# EAGLE schematic MJ828 - POC (EAGLE 9.4.0)
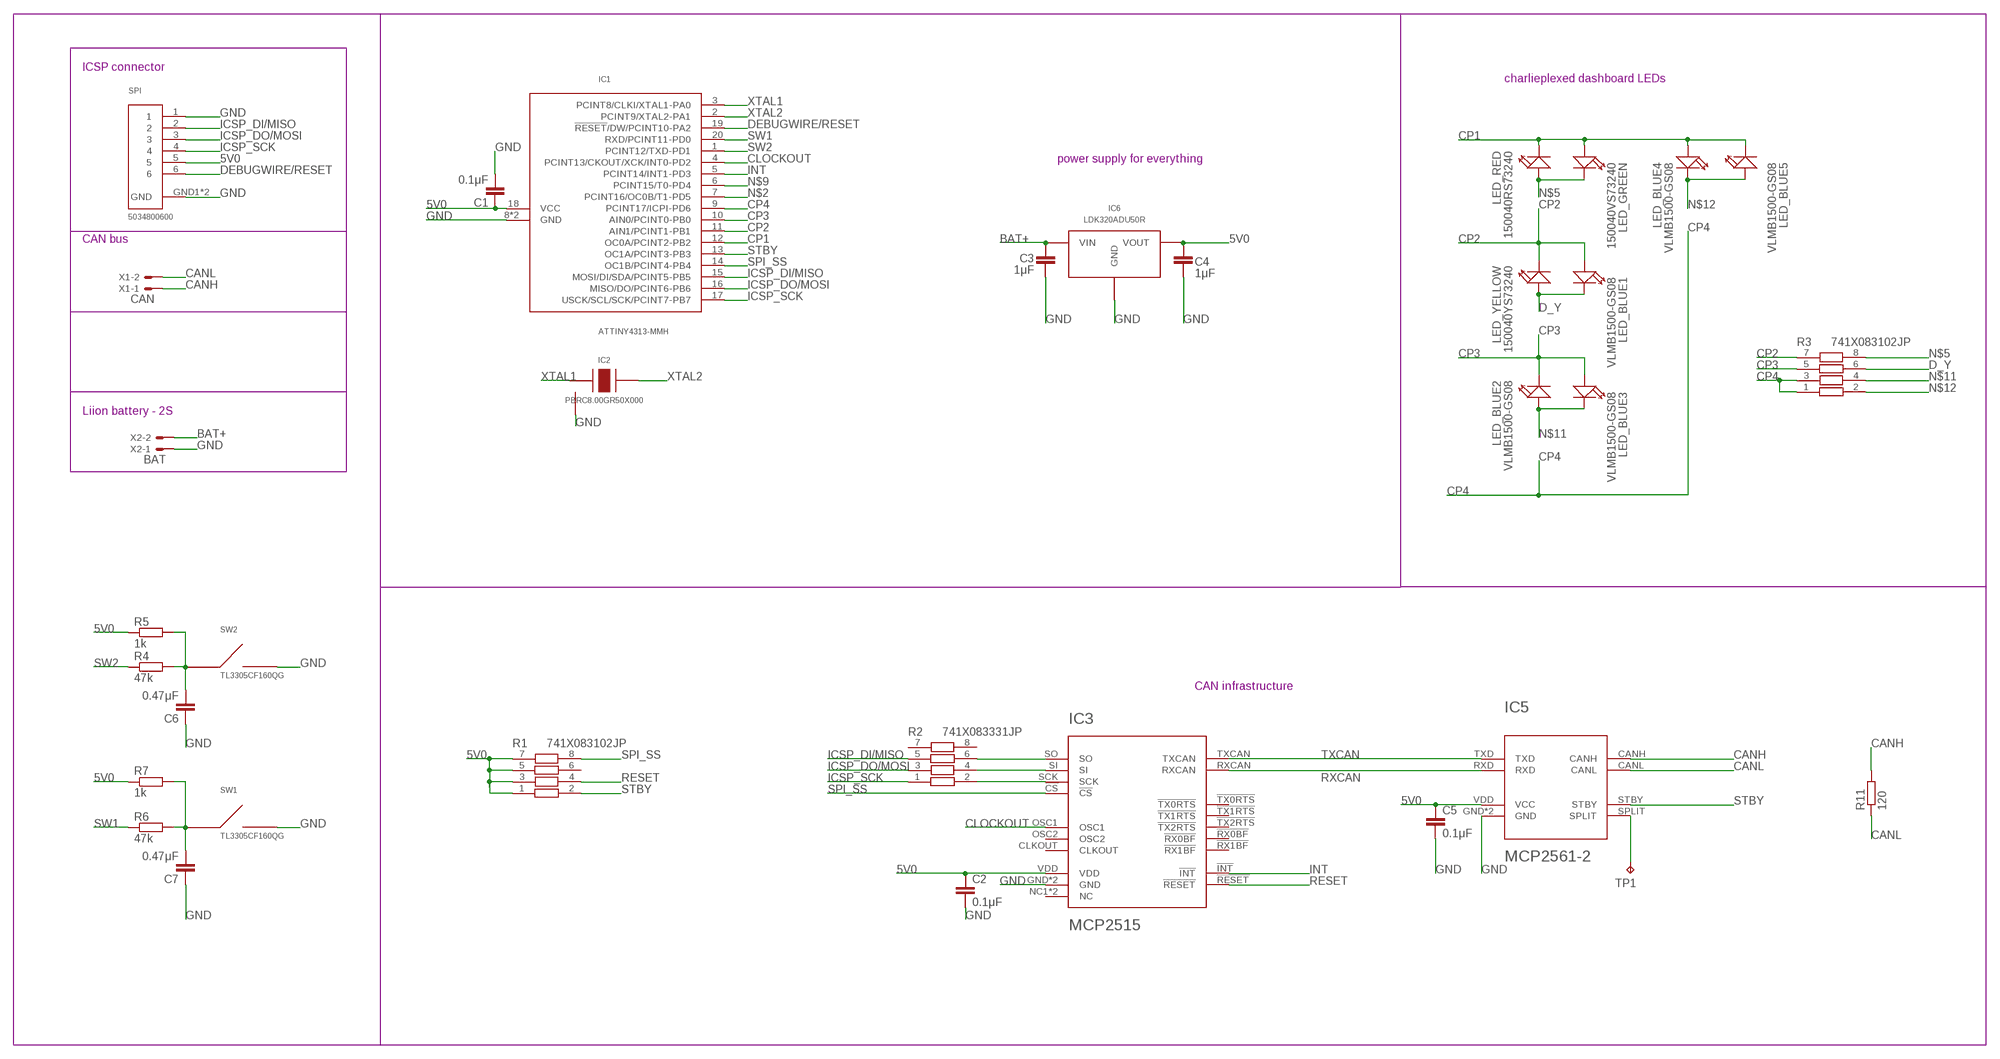
[diagram p0: schematic, sheet 1]

## Parts
C1  0.1μF  C-EUC0402  [C0402]
C2  0.1μF  C-EUC0402  [C0402]
C3  1μF  C-EUC0402  [C0402]
C4  1μF  C-EUC0402  [C0402]
C5  0.1μF  C-EUC0402  [C0402]
C6  0.47μF  C-EUC0402  [C0402]
C7  0.47μF  C-EUC0402  [C0402]
IC1  ATTINY4313-MMH  ATTINY4313VQFN-20  [VQFN-20]
IC2  PBRC8.00GR50X000  PRQV  [SMT]
IC3  MCP2515  MCP2515-I-ML  [QFN20]
IC5  MCP2561-2  [DFN10]
IC6  LDK320ADU50R  LDO  [SOT-89]
LED_BLUE1  VLMB1500-GS08  SMD-LED-CLEAR-BLUE(0402)  [LED-0402]
LED_BLUE2  VLMB1500-GS08  SMD-LED-CLEAR-BLUE(0402)  [LED-0402]
LED_BLUE3  VLMB1500-GS08  SMD-LED-CLEAR-BLUE(0402)  [LED-0402]
LED_BLUE4  VLMB1500-GS08  SMD-LED-CLEAR-BLUE(0402)  [LED-0402]
LED_BLUE5  VLMB1500-GS08  SMD-LED-CLEAR-BLUE(0402)  [LED-0402]
LED_GREEN  150040VS73240  SMD-LED-CLEAR-BLUE(0402)  [LED-0402]
LED_RED  150040RS73240  SMD-LED-CLEAR-BLUE(0402)  [LED-0402]
LED_YELLOW  150040YS73240  SMD-LED-CLEAR-BLUE(0402)  [LED-0402]
R1  741X083102JP  741X083331JP  [0402]
R2  741X083331JP  [0402]
R3  741X083102JP  741X083331JP  [0402]
R4  47k  R-EU_R0402  [R0402]
R5  1k  R-EU_R0402  [R0402]
R6  47k  R-EU_R0402  [R0402]
R7  1k  R-EU_R0402  [R0402]
R11  120  R-EU_R0805  [R0805]
SPI  5034800600  [SMT]
SW1  TL3305CF160QG  TL3305-844809  [SMD]
SW2  TL3305CF160QG  TL3305-844809  [SMD]
TP1  TPB2,54  [B2,54]
X1  CAN  22-23-2021  [22-23-2021]
X2  BAT  22-23-2021  [22-23-2021]

## Nets
5V0 [5V0CAN]: C1.1 C2.1 C4.2 C5.1 IC1.18(VCC) IC3.VDD IC5.VDD(VCC) IC6.VOUT R1.1 R1.3 R1.5 R1.7 R5.1 R7.1 SPI.5
BAT+ [currett-0.45]: C3.1 IC6.VIN X2.2
CANH [signal]: IC5.CANH R11.2 X1.1
CANL [signal]: IC5.CANL R11.1 X1.2
CLOCKOUT [signal]: IC1.4(PCINT13/CKOUT/XCK/INT0-PD2) IC3.OSC1
CP1 [signal]: IC1.12(OC0A/PCINT2-PB2) LED_BLUE4.+ LED_BLUE5.- LED_GREEN.+ LED_RED.-
CP2 [signal]: IC1.11(AIN1/PCINT1-PB1) LED_BLUE1.+ LED_YELLOW.- R3.7
CP3 [signal]: IC1.10(AIN0/PCINT0-PB0) LED_BLUE2.- LED_BLUE3.+ R3.5
CP4 [signal]: IC1.9(PCINT17/ICPI-PD6) R3.1 R3.3
D_Y [signal]: LED_BLUE1.- LED_YELLOW.+ R3.6
DEBUGWIRE/RESET [signal]: IC1.19(!RESET!/DW/PCINT10-PA2) SPI.6
GND: C1.2 C2.2 C3.2 C4.1 C5.2 C6.1 C7.1 IC1.8(GND) IC1.GND IC2.GND IC3.GND IC3.GND6(GND) IC5.GND IC5.VSS(GND) IC6.GND SPI.1 SPI.GND1(GND) SPI.GND2(GND) SW1.3 SW1.4 SW2.3 SW2.4 X2.1
ICSP_DI/MISO [signal]: IC1.15(MOSI/DI/SDA/PCINT5-PB5) R2.5 SPI.2
ICSP_DO/MOSI [signal]: IC1.16(MISO/DO/PCINT6-PB6) R2.3 SPI.3
ICSP_SCK [signal]: IC1.17(USCK/SCL/SCK/PCINT7-PB7) R2.1 SPI.4
INT [signal]: IC1.5(PCINT14/INT1-PD3) IC3.!INT!
N$1: C6.2 R4.2 R5.2 SW2.1 SW2.2
N$2: IC1.7(PCINT16/OC0B/T1-PD5)
N$5 [signal]: LED_GREEN.- LED_RED.+ R3.8
N$7: C7.2 R6.2 R7.2 SW1.1 SW1.2
N$9: IC1.6(PCINT15/T0-PD4)
N$11 [signal]: LED_BLUE2.+ LED_BLUE3.- R3.4
N$12 [signal]: LED_BLUE4.- LED_BLUE5.+ R3.2
RESET [signal]: IC3.!RESET! R1.4
RXCAN [signal]: IC3.RXCAN IC5.RXD
SPI_SCK [signal]: IC3.SCK R2.2
SPI_SI [signal]: IC3.SI R2.4
SPI_SO [signal]: IC3.SO R2.6
SPI_SS [signal]: IC1.14(OC1B/PCINT4-PB4) IC3.!CS! R1.8
SPLIT: IC5.SPLIT TP1.TP
STBY [signal]: IC1.13(OC1A/PCINT3-PB3) IC5.STBY R1.2
SW1 [signal]: IC1.20(RXD/PCINT11-PD0) R6.1
SW2 [signal]: IC1.1(PCINT12/TXD-PD1) R4.1
TXCAN [signal]: IC3.TXCAN IC5.TXD
XTAL1 [signal]: IC1.3(PCINT8/CLKI/XTAL1-PA0) IC2.XTAL1
XTAL2 [signal]: IC1.2(PCINT9/XTAL2-PA1) IC2.XTAL2
Unconnected: IC3.!RX0BF! IC3.!RX1BF! IC3.!TX0RTS! IC3.!TX1RTS! IC3.!TX2RTS! IC3.CLKOUT IC3.NC1(NC) IC3.NC2(NC) IC3.OSC2 R1.6 R2.7 R2.8

## Notes on the sheet
- ICSP connector
- charlieplexed dashboard LEDs
- power supply for everything
- CAN bus
- Liion battery - 2S
- CAN infrastructure

## Library data of the parts
C1-C7 = rcl:C-EU: CAPACITOR, European symbol; SPICEPREFIX: C
IC1 = ATtiny4313 microcontroller:ATTINY4313; SPICEPREFIX: X
IC2 = PRQV8.00CR1510Y00L - 8MHz resonator:PRQV
IC3 = MCP2515-I-ML - Standalonce CAN Controller with SPI Interface:MCP2515-I-ML
IC5 = MCP2561-2 - High-Speed CAN Transceiver:MCP2561-2
IC6 = LDO SOT-89:LDO
LED_BLUE1-LED_BLUE5 LED_GREEN LED_RED LED_YELLOW = Seeed-LED:SMD-LED-CLEAR-BLUE(0402): 304090075; MPN: BL-HB337A-AV-TRB; VALUE: BLUE-0402
R1-R3 = 741X083331JP Resistor Array:741X083331JP
R4-R7 R11 = rcl:R-EU_: RESISTOR, European symbol; SPICEPREFIX: R
SPI = 5034800600 FPC Connector:5034800600
SW1 SW2 = TL3305-844809 SPST-NO Tact Switch:TL3305-844809
TP1 = testpad:TP: Test pad
X1 X2 = con-molex:22-23-2021: .100" (2.54mm) Center Header - 2 Pin; MF: MOLEX; MPN: 22-23-2021; OC_FARNELL: 1462926; OC_NEWARK: 25C3832

## Net classes
0 GND: width 0.254 mm, drill 0.254 mm, clearance 0.127 mm
1 VCC: width 0.254 mm, drill 0.254 mm, clearance 0.127 mm
2 signal: width 0.127 mm, drill 0.254 mm, clearance 0.127 mm
3 5V0CAN: width 0.3 mm, drill 0.35 mm, clearance 0.2 mm
4 5V0_μC: width 0.25 mm, drill 0.25 mm, clearance 0.2 mm
5 currett-0.45: width 0.45 mm, drill 0.35 mm, clearance 0.2 mm